# EAGLE schematic PiezoPreamp_V4 (EAGLE 7.5.0)
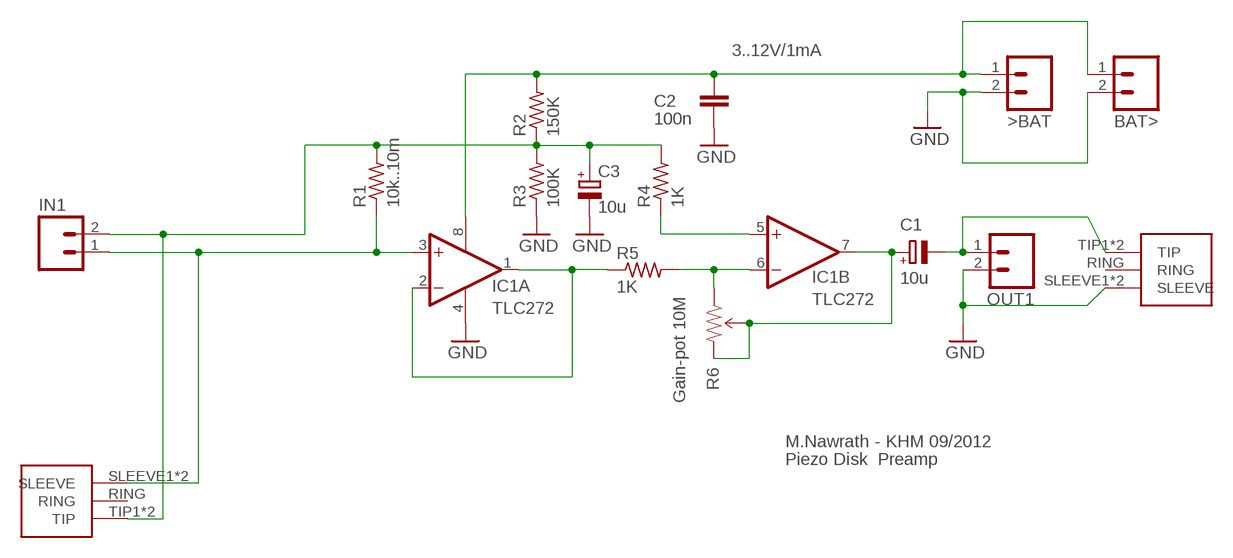
[diagram p0: schematic, sheet 1]

## Parts
>BAT  M02LOCK  [1X02_LOCK]
BAT>  M02LOCK  [1X02_LOCK]
C1  10u  CPOL-EUE2.5-5  [E2,5-5]
C2  100n  C-EU025-025X050  [C025-025X050]
C3  10u  CPOL-EUE2.5-5  [E2,5-5]
IC1  TLC272  TLC272P  [DIL08]
IN1  M02LOCK  [1X02_LOCK]
OUT1  M02LOCK  [1X02_LOCK]
OUT1-TRS  1/8"-F-STEREO-PCB  [1/8"-F-STEREO-PCB]
R1  10k..10m  R-US_0204/2V  [0204V]
R2  150K  R-US_0204/2V  [0204V]
R3  100K  R-US_0204/2V  [0204V]
R4  1K  R-US_0204/2V  [0204V]
R5  1K  R-US_0204/2V  [0204V]
R6  Gain-pot 10M  TRIMPOT-PTH-KNOB  [3386U]
U$2  1/8"-F-STEREO-PCB  [1/8"-F-STEREO-PCB]

## Nets
GND: >BAT.2 BAT>.2 C2.1 C3.- IC1.4(P:V-) OUT1-TRS.SLEEVE1(SLEEVE) OUT1-TRS.SLEEVE2(SLEEVE) OUT1.2 R3.1
N$1: C3.+ IN1.2 R1.2 R2.1 R3.2 R4.2 U$2.TIP1(TIP) U$2.TIP2(TIP)
N$2: IC1.6(B:-IN) R5.2 R6.1(CCW)
N$3: C1.- OUT1-TRS.TIP1(TIP) OUT1-TRS.TIP2(TIP) OUT1.1
N$5: IC1.5(B:+IN) R4.1
N$6: C1.+ IC1.7(B:OUT) R6.2(WIPER) R6.3(CW)
N$8: IC1.3(A:+IN) IN1.1 R1.1 U$2.SLEEVE1(SLEEVE) U$2.SLEEVE2(SLEEVE)
N$14: IC1.1(A:OUT) IC1.2(A:-IN) R5.1
V9V: >BAT.1 BAT>.1 C2.2 IC1.8(P:V+) R2.2
Unconnected: OUT1-TRS.RING U$2.RING

## Notes on the sheet
- 3..12V/1mA
- M.Nawrath - KHM 09/2012
- Piezo Disk  Preamp

## Library data of the parts
>BAT BAT> IN1 OUT1 = SparkFun-Connectors:M02: Header 2 Standard 2-pin 0.1" header. Use with straight break away headers (SKU : PRT-00116), right angle break away headers (PRT-00553), swiss pins (PRT-00743), machine pins (PRT-00117), and female headers (PRT-00115). Molex polarized connector foot print use with SKU : PRT-08233 with associated crimp pins and housings.
C1 C3 = rcl:CPOL-EU: POLARIZED CAPACITOR, European symbol
C2 = rcl:C-EU: CAPACITOR, European symbol
IC1 = linear:TLC272: OP AMP
OUT1-TRS U$2 = CMU-ArtFab:1/8"-F-STEREO-PCB
R1-R5 = resistor:R-US_: RESISTOR, American symbol
R6 = SparkFun-Electromechanical:TRIMPOT: Various small potentiometers for "set-and-forget" applications